# EAGLE schematic McPiFace-HDMI-ConnectorPanel-V1 (EAGLE 7.4.0)
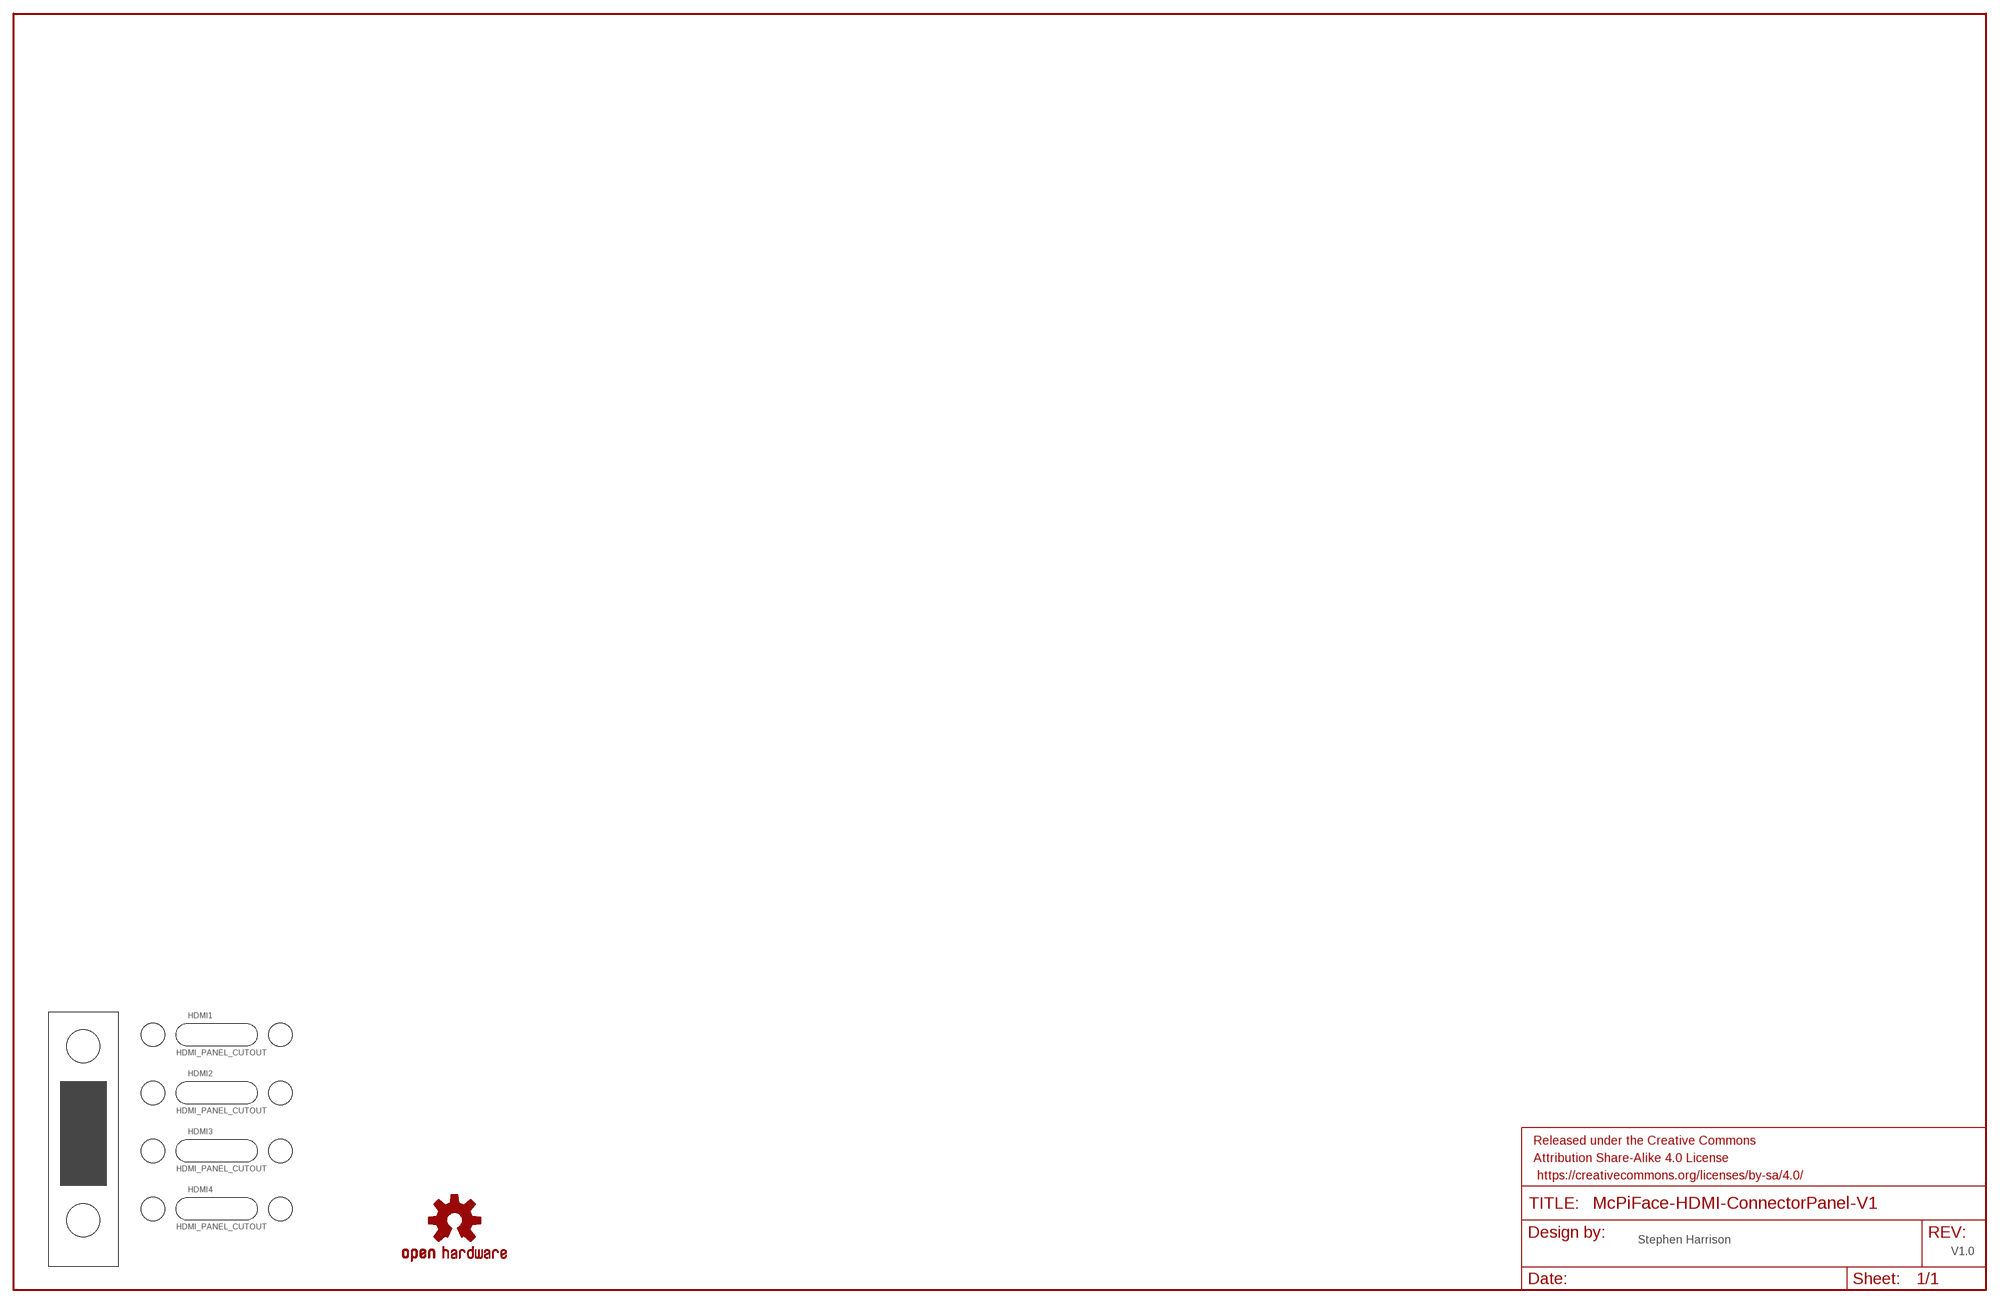
[diagram p0: schematic, sheet 1]

## Parts
FRAME1  FRAME-LEDGER  [CREATIVE_COMMONS]
HDMI1  HDMI_PANEL_CUTOUT  [HDMI_PANEL_CUTOUT]
HDMI2  HDMI_PANEL_CUTOUT  [HDMI_PANEL_CUTOUT]
HDMI3  HDMI_PANEL_CUTOUT  [HDMI_PANEL_CUTOUT]
HDMI4  HDMI_PANEL_CUTOUT  [HDMI_PANEL_CUTOUT]
LOGO1  OSHW-LOGOM  [OSHW-LOGO-M]
U$1  MC_PI_FACE_PANELSINGLE_BLANK  [MC_PI_SINGE_BLANK_FACE]

## Notes on the sheet
- Stephen Harrison
- V1.0

## Library data of the parts
FRAME1 = SparkFun-Aesthetics:FRAME-LEDGER: Schematic Frame - Ledger Standard 11x14 US Ledger frame
HDMI1-HDMI4 = McPiFace:HDMI_PANEL_CUTOUT: Panel cutout for panel mount HDMI panel mount leads. e.g. https://shop.pimoroni.com/products/panel-mount-extension-cables?variant=28271043079 Should also work for USB B panel mount.
LOGO1 = SparkFun-Aesthetics:OSHW-LOGO: Open-Source Hardware (OSHW) Logo This logo indicates the piece of hardware it is found on incorporates a OSHW license and/or adheres to the definition of open source hardware found here: http://freedomdefined.org/OSHW
U$1 = McPiFace:MC_PI_FACE_PANEL